# EAGLE design board (EAGLE 7.5.0)
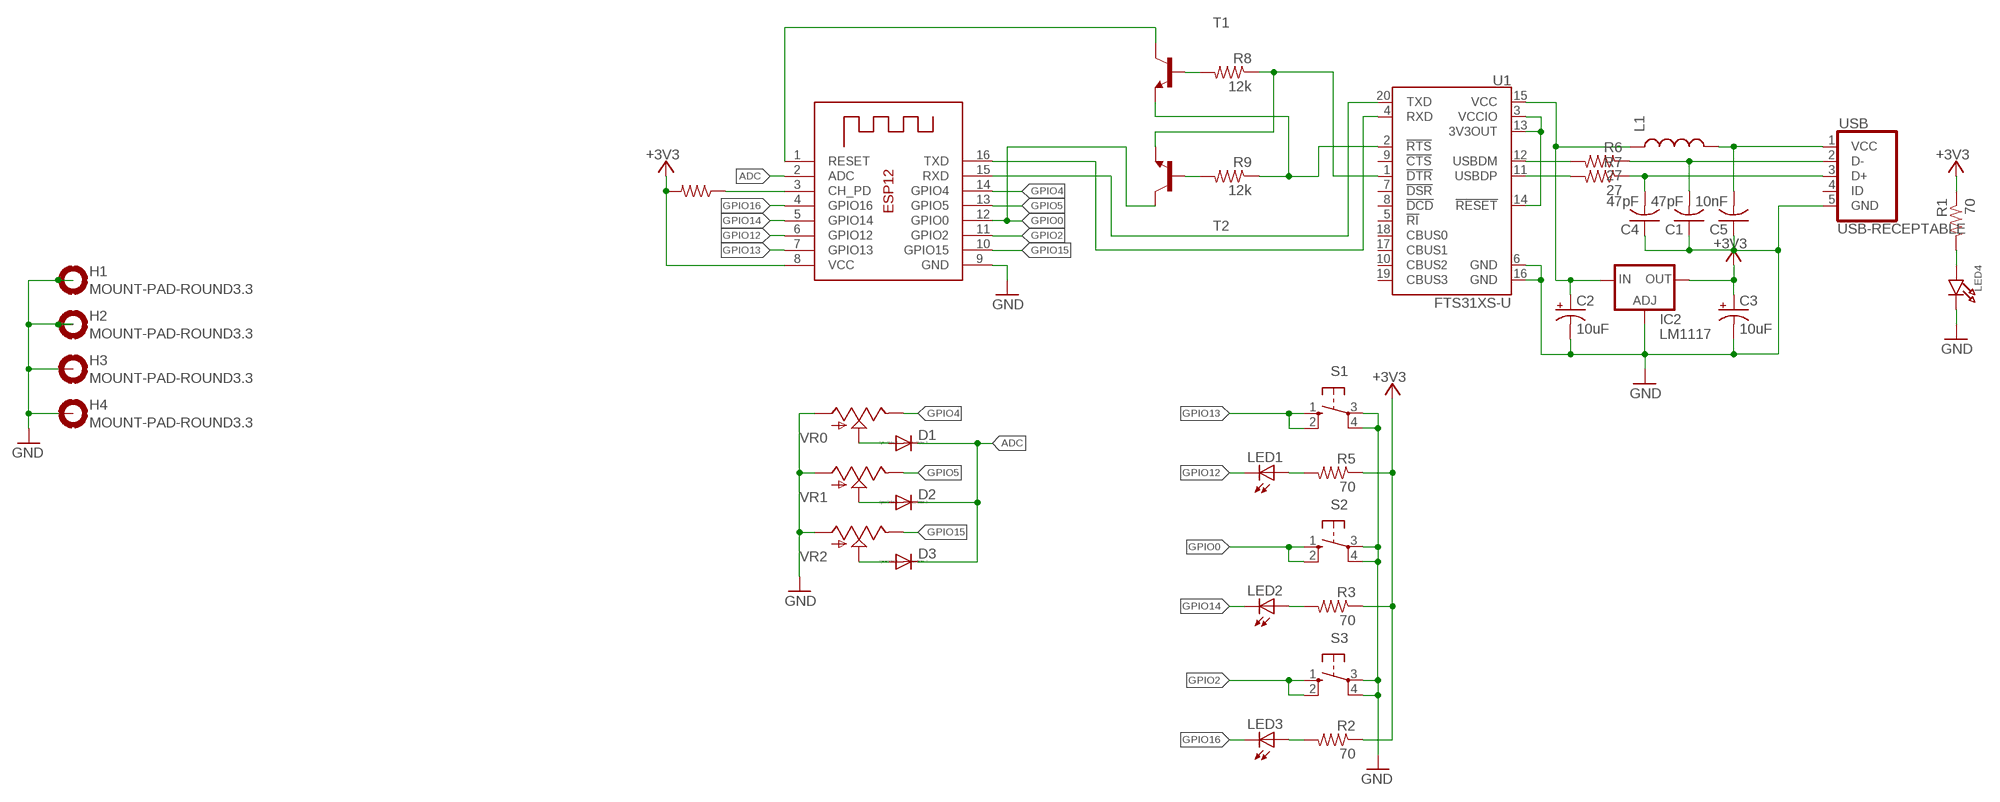
[diagram p0: schematic, sheet 1]

## Parts
C1  47pF  C-USC0603  [C0603]
C2  10uF  CPOL-US153CLV-0405  [153CLV-0405]
C3  10uF  CPOL-US153CLV-0405  [153CLV-0405]
C4  47pF  C-USC0603  [C0603]
C5  10nF  C-USC0603  [C0603]
D1  DIODE-DO214AC  [DO214AC]
D2  DIODE-DO214AC  [DO214AC]
D3  DIODE-DO214AC  [DO214AC]
H1  MOUNT-PAD-ROUND3.3  [3,3-PAD]
H2  MOUNT-PAD-ROUND3.3  [3,3-PAD]
H3  MOUNT-PAD-ROUND3.3  [3,3-PAD]
H4  MOUNT-PAD-ROUND3.3  [3,3-PAD]
IC2  LM1117  LD117ADT-TR  [DPACK]
L1  INDUCTOR0805  [0805]
LED1  LED3MM  [LED3MM]
LED2  LED3MM  [LED3MM]
LED3  LED3MM  [LED3MM]
LED4  LED0805  [CHIPLED_0805]
R1  70  R-US_R0603  [R0603]
R2  70  R-US_R0603  [R0603]
R3  70  R-US_R0603  [R0603]
R4  10k  R-US_R0603  [R0603]
R5  70  R-US_R0603  [R0603]
R6  27  R-US_R0603  [R0603]
R7  27  R-US_R0603  [R0603]
R8  12k  R-US_R0603  [R0603]
R9  12k  R-US_R0603  [R0603]
S1  10-XX  [B3F-10XX]
S2  10-XX  [B3F-10XX]
S3  10-XX  [B3F-10XX]
T1  MMBT918LT1-NPN-SOT23-BEC  [SOT23-BEC]
T2  MMBT918LT1-NPN-SOT23-BEC  [SOT23-BEC]
U1  FTS31XS-U  FT231XS  [SSOP20_L]
USB  USB-RECEPTABLE  [FCI-10103594-0001LF]
VR0  SLIDERPTA3043  [PTA3043-2015CPB103]
VR1  SLIDERPTA3043  [PTA3043-2015CPB103]
VR2  SLIDERPTA3043  [PTA3043-2015CPB103]
X1  ESP-12  [ESP-12]

## Nets
+3V3: C3.+ IC2.4(OUT) R1.1 R2.1 R3.1 R4.2 R5.1 X1.8(VCC)
ADC: D1.C D2.C D3.C X1.2(ADC)
GND: C1.1 C2.- C3.- C4.1 C5.1 H1.B3,3(MOUNT) H2.B3,3(MOUNT) H3.B3,3(MOUNT) H4.B3,3(MOUNT) IC2.1(ADJ) LED4.C S1.3(P) S1.4(P1) S2.3(P) S2.4(P1) S3.3(P) S3.4(P1) U1.6(GND) U1.16(GND) USB.5(GND) VR0.P$1(A) VR1.P$1(A) VR2.P$1(A) X1.9(GND)
GPIO0: S2.1(S) S2.2(S1) T2.C X1.12(GPIO0)
GPIO2: S3.1(S) S3.2(S1) X1.11(GPIO2)
GPIO4: VR0.P$3(E) X1.14(GPIO4)
GPIO5: VR1.P$3(E) X1.13(GPIO5)
GPIO12: LED1.K(C) X1.6(GPIO12)
GPIO13: S1.1(S) S1.2(S1) X1.7(GPIO13)
GPIO14: LED2.K(C) X1.5(GPIO14)
GPIO15: VR2.P$3(E) X1.10(GPIO15)
GPIO16: LED3.K(C) X1.4(GPIO16)
N$1: R4.1 X1.3(CH_PD)
N$2: C4.2 R7.1 USB.3(D+)
N$3: R7.2 U1.11(USBDP)
N$4: LED4.A R1.2
N$5: D1.A VR0.P$2(S)
N$6: LED1.A R5.2
N$7: C5.2 L1.2 USB.1(VCC)
N$8: LED2.A R3.2
N$9: R6.2 U1.12(USBDM)
N$10: LED3.A R2.2
N$11: D2.A VR1.P$2(S)
N$12: D3.A VR2.P$2(S)
N$13: C1.2 R6.1 USB.2(D-)
N$14: R8.1 T2.E U1.1(!DTR)
N$15: R9.1 T1.E U1.2(!RTS)
N$16: R8.2 T1.B
N$17: R9.2 T2.B
N$19: U1.3(VCCIO) U1.13(3V3OUT) U1.14(!RESET)
N$20: C2.+ IC2.3(IN) L1.1 U1.15(VCC)
RST: T1.C X1.1(RESET)
RXI: U1.20(TXD) X1.15(RXD)
TXO: U1.4(RXD) X1.16(TXD)
Unconnected: U1.5(!RI) U1.7(!DSR) U1.8(!DCD) U1.9(!CTS) U1.10(CBUS2) U1.17(CBUS1) U1.18(CBUS0) U1.19(CBUS3) USB.4(ID)

## Library data of the parts
C1 C4 C5 = rcl:C-US: CAPACITOR, American symbol
C2 C3 = rcl:CPOL-US: POLARIZED CAPACITOR, American symbol
D1-D3 = diode:DIODE-: DIODE
H1-H4 = holes:MOUNT-PAD-ROUND: MOUNTING PAD, round
IC2 = v-reg:LD117A?*: Low drop fixed and adjustable positive voltage regulators 1 A Source: http://www.st.com/stonline/products/literature/ds/7194/ld1117axx.pdf
L1 = SparkFun-Passives:INDUCTOR: Inductors Basic Inductor/Choke - 0603 and 1206. Footprints are not proven and vary greatly between part numbers. INDUCTOR POWER 3.3UH 4.0A SMD 0.197" L x 0.197" W x 0.177" H (5.00mm x 5.00mm x 4.50mm)
LED1-LED3 = adafruit:LED: LED
LED4 = microbuilder:LED: LED
R1-R9 = resistor:R-US_: RESISTOR, American symbol
S1-S3 = switch-omron:10-XX: OMRON SWITCH; MPN: B3F-1000; OC_FARNELL: 176432; OC_NEWARK: 36M3542
T1 T2 = transistor:*-NPN-: NPN Transistror BF959 corrected 2008.03.06
U1 = SparkFun-DigitalIC:FT231X: FTDI FT231X Full Speed USB to Full-handshake UART This USB2.0 Full Speed IC offers a compact bridge to full handshake UART interfaces. The device is a UART, capable of operating up to 3MBaud, with low power consumption (8mA). The FT231X includes the complete FT-X series feature set and enables USB to be added into a system design quickly and easily over a UART interface.; PROD_ID: IC-11524
USB = daspilker:USB-RECEPTABLE: USB Receptable
VR0 VR1 VR2 = SparkFun-Electromechanical:SLIDER: Slide-type potentiometers. Small and meduim footprints untested.
X1 = adafruit:ESP-12

## Net classes
1 ext: width 1.93 mm, clearance 1 mm
2 5v: width 0.61 mm

## Board
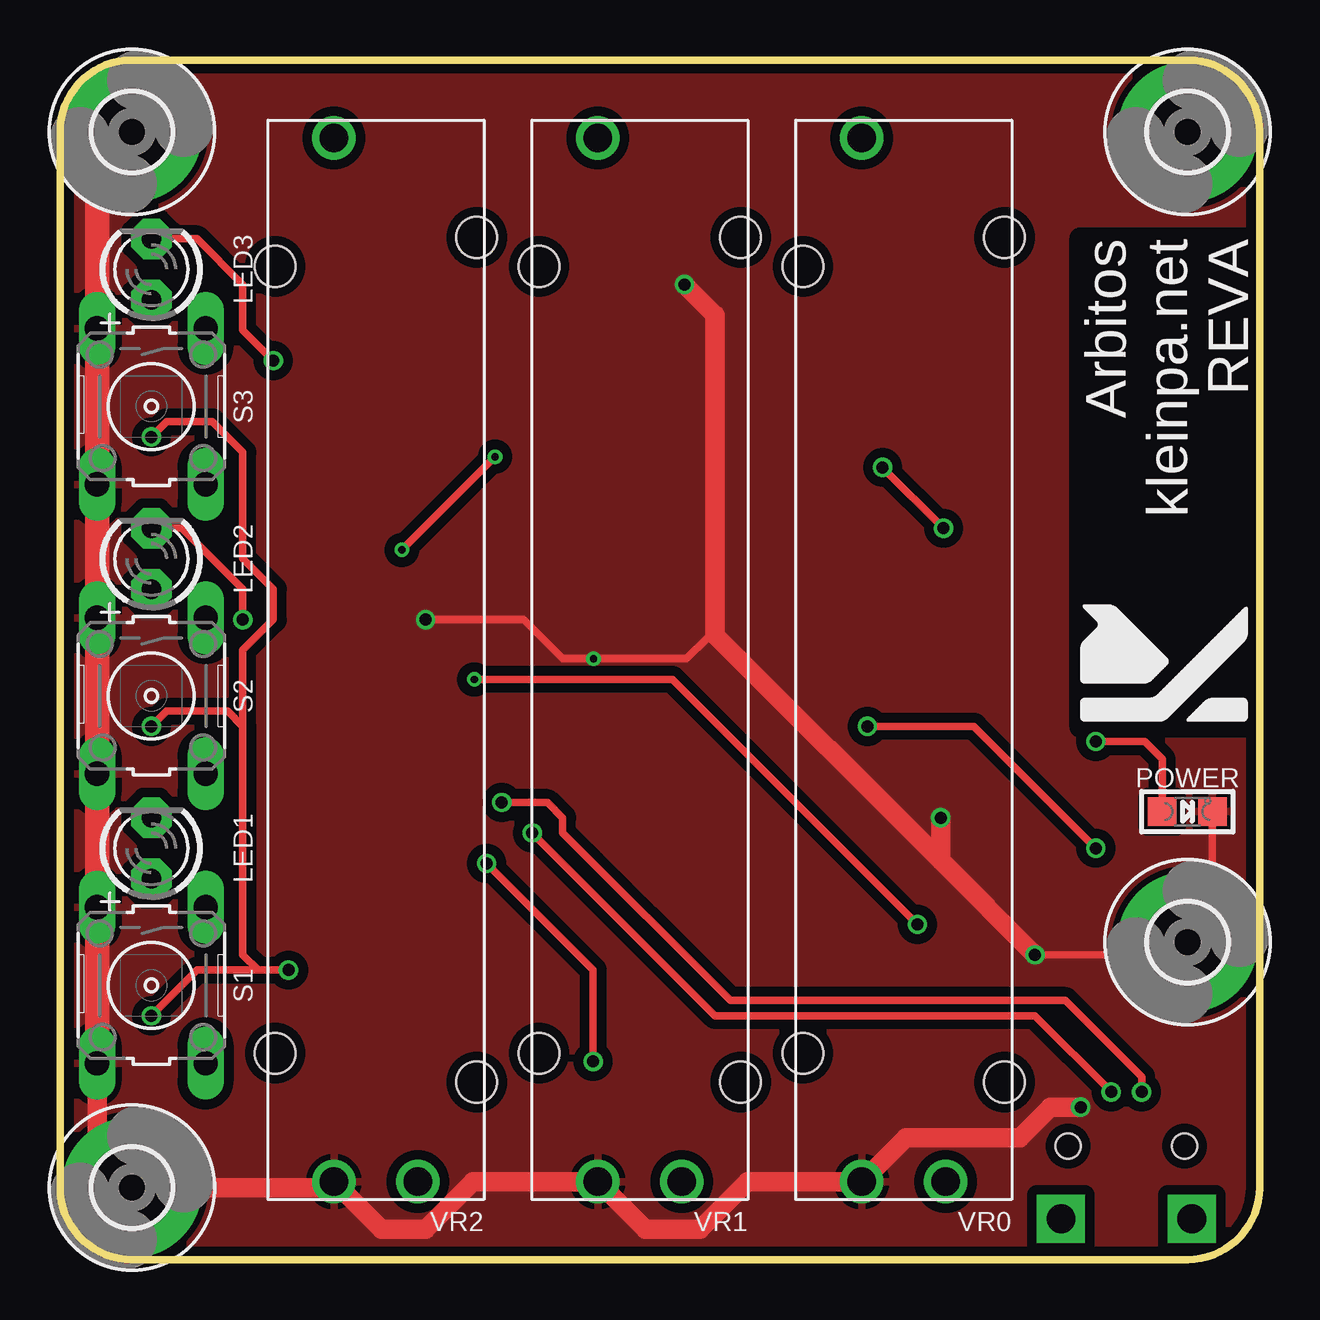
[diagram p1: board, top side]
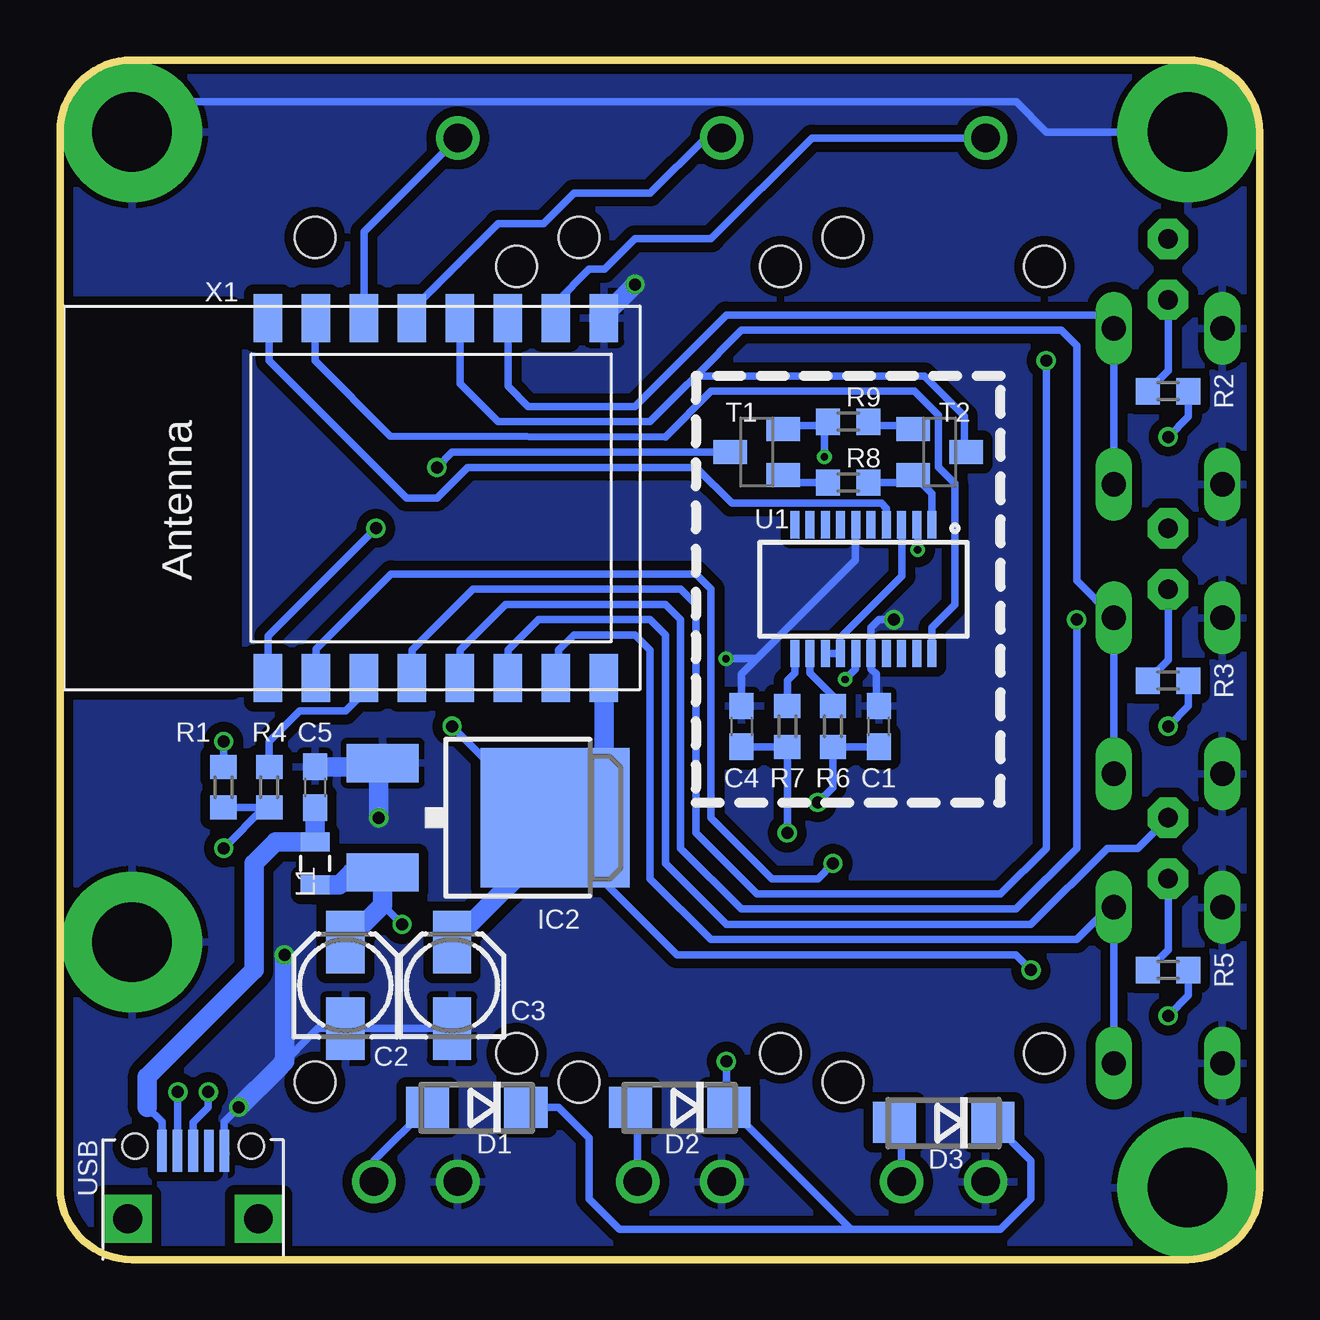
[diagram p2: board, bottom side, seen from below]

Size 50 x 50 mm. Coordinates in mm from the lower left corner, seen from the top.
Outline: 0,47 0,3 arc90 3,0 47,0 arc90 50,3 50,47 arc90 47,50 3,50 arc90 0,47
Copper layers (1*16): Top 0.035mm / dielectric 1.5mm / Bottom 0.035mm
Design rules "dirt_cheap_dirty_boards.v1": minimum track width 5mil, minimum drill 12mil, track to track 5mil, track to pad 5mil, pad to pad 5mil, via to via 5mil, smd to smd 0mil, copper to edge 10mil, drill to drill 10mil, minimum pad ring 10mil, minimum via ring 6mil, stop-mask expansion 2mil, vias tented up to drill 25mil, thermal gap 10mil

### Footprints (pad centres in the part's own frame; a part is rotated, then mirrored left to right if it is on the bottom)
C0603 = smd 1.1 x 1: 1 -0.85,0; 2 0.85,0
153CLV-0405 = smd 2.6 x 1.6: + 1.8,0; - -1.8,0
DO214AC = smd 1.8 x 1.7: A 2.05,0; C -2.05,0
3,3-PAD = drill 3.3 pad 5.842: B3,3 0,0
DPACK = smd 1.6 x 3: 1 -2.28,-4.8; 3 2.28,-4.8 | smd 5.8 x 6.2: 4 0,2.38
0805 = smd 0.8 x 1.2: 1 -0.9,0; 2 0.9,0
LED3MM = drill 0.813 pad 1.676 octagon: A -1.27,0; K 1.27,0
CHIPLED_0805 = smd 1.2 x 1.2: A 0,-1.05; C 0,1.05
R0603 = smd 1 x 1.1: 1 -0.85,0; 2 0.85,0
B3F-10XX = drill 1.016 long: 1 -3.251,2.261; 2 3.251,2.261; 3 -3.251,-2.261; 4 3.251,-2.261
SOT23-BEC = smd 1 x 1.4: B -0.95,-1.1; C 0,1.1; E 0.95,-1.1
SSOP20_L = smd 0.381 x 1.143: 1 -2.857,-2.68; 2 -2.223,-2.68; 3 -1.587,-2.68; 4 -0.953,-2.68; 5 -0.318,-2.68; 6 0.318,-2.68; 7 0.953,-2.68; 8 1.587,-2.68; 9 2.223,-2.68; 10 2.857,-2.68; 11 2.857,2.68; 12 2.223,2.68; 13 1.587,2.68; 14 0.953,2.68; 15 0.318,2.68; 16 -0.318,2.68; 17 -0.953,2.68; 18 -1.587,2.68; 19 -2.223,2.68; 20 -2.857,2.68
FCI-10103594-0001LF = smd 0.4 x 1.75: 1 -1.3,4.525; 2 -0.65,4.525; 3 0,4.525; 4 0.65,4.525; 5 1.3,4.525 | drill 1.2 pad 2 square: P$3 -2.725,1.7; P$4 2.725,1.7 | hole 1.05: -2.425,4.73; 2.425,4.73
PTA3043-2015CPB103 = drill 1.2: P$1 -21.75,1.75; P$2 -21.75,-1.75; P$3 21.75,1.75 | hole 1.7: -16.4,4.2; 16.4,4.2; -17.6,-4.2; 17.6,-4.2
ESP-12 = smd 2 x 1.2: 1 -7.5,4.5; 2 -7.5,2.5; 3 -7.5,0.5; 4 -7.5,-1.5; 5 -7.5,-3.5; 6 -7.5,-5.5; 7 -7.5,-7.5; 8 -7.5,-9.5; 9 7.5,-9.5; 10 7.5,-7.5; 11 7.5,-5.5; 12 7.5,-3.5; 13 7.5,-1.5; 14 7.5,0.5; 15 7.5,2.5; 16 7.5,4.5

### Placement (x,y rotation side)
C1  15.88,22.23 270 bottom
C2  38.1,11.43 90 bottom
C3  33.66,11.43 90 bottom
C4  21.59,22.23 270 bottom
C5  39.37,19.68 270 bottom
D1  32.63,6.35 180 bottom
D2  24.17,6.35 180 bottom
D3  13.17,5.71 180 bottom
H1  47,13.23 0 top
H2  3,3 0 top
H3  47,47 0 top
H4  3,47 0 top
IC2  31.75,18.41 270 bottom
L1  39.37,16.51 90 bottom
LED1  3.81,17.14 90 top
LED2  3.81,29.21 90 top
LED3  3.81,41.27 90 top
LED4  46.99,18.67 270 top
R1  43.18,19.68 90 bottom
R2  3.81,36.2 180 bottom
R3  3.81,24.13 180 bottom
R4  41.27,19.68 270 bottom
R5  3.81,12.06 180 bottom
R6  17.78,22.23 90 bottom
R7  19.68,22.23 90 bottom
R8  17.14,32.38 180 bottom
R9  17.14,34.92 0 bottom
S1  3.81,11.43 270 top
S2  3.81,23.5 270 top
S3  3.81,35.56 270 top
T1  20.95,33.66 90 bottom
T2  13.34,33.66 270 bottom
U1  16.51,27.94 180 bottom
USB  44.45,0 0 bottom
VR0  35.17,25 90 top
VR1  24.17,25 90 top
VR2  13.17,25 90 top
X1  36.83,31.75 90 bottom

### Tracks (layer width: path | path; a pad name or v marks a point on that pad's centre or on a via)
+3V3  (via drill 0.5)
  Top 0.305: v3.81,34.29 4.45,34.92 6.35,34.92 7.62,33.66 7.62,29.21 8.89,27.94 8.89,26.67 7.62,25.4 7.62,22.23 | v3.81,10.16 5.71,12.06 8.26,12.06 | 8.26,12.06 v9.53,12.06 | v3.81,22.23 4.45,22.86 6.99,22.86 7.62,22.23 | v43.18,17.14 38.1,22.23 v33.66,22.23 | 7.62,22.23 7.62,12.7 8.26,12.06
  Bottom 0.305: R2.1 2.96,35.14 v3.81,34.29 | v9.53,12.06 10.16,12.7 24.29,12.7 29.37,17.78 | R5.1 2.96,11.01 v3.81,10.16 | R3.1 2.96,23.07 v3.81,22.23 | R1.1 R4.2 41.49,18.84 v43.18,17.14 | v33.66,22.23 30.24,18.81 28.97,18.81
  Bottom 0.813: C3.+ 29.37,17.52 29.37,17.78 IC2.4 28.97,18.81 27.33,20.45 X1.8
ADC  (via drill 0.5)
  Top 0.305: v17.78,16.51 22.23,12.06 v22.23,8.26
  Bottom 0.305: 17.04,1.27 10.79,1.27 9.53,2.54 9.53,4.12 D3.C | 17.04,1.27 D2.C 22.23,6.35 v22.23,8.26 | 17.04,1.27 22.23,1.27 22.86,1.27 26.67,1.27 27.94,2.54 27.94,5.08 29.21,6.35 D1.C | X1.2 39.33,25.44 36.2,28.57 23.5,28.57 22.86,27.94 22.86,18.41 20.32,15.88 18.41,15.88 v17.78,16.51
GND  (via drill 0.3, 0.5)
  Top 0.305: v40.64,12.7 46.47,12.7 H1.B3,3 48.04,14.27 LED4.C | 27.3,26.04 26.99,25.91 26.12,25.04 v22.24,25.04 20.94,25.04 19.32,26.67 v15.24,26.67
  Top 0.813: S1.4 1.55,4.45 H2.B3,3 11.17,3 VR2.P$1 13.4,1.27 15.24,1.27 17.22,3.25 VR1.P$1 24.4,1.27 26.67,1.27 28.65,3.25 VR0.P$1 35.25,5.08 40.01,5.08 41.27,6.35 v42.55,6.35 | v36.71,18.41 36.71,16.63 | 36.71,16.63 v40.64,12.7 | 36.71,16.63 27.3,26.04 27.3,39.37 v26.04,40.64
  Top 1.016: S1.4 S1.3 S2.4 S2.3 S3.4 S3.3 1.55,45.55 H4.B3,3
  Bottom 0.305: USB.5 43.15,5.75 v42.55,6.35 | H3.B3,3 45.74,48.26 10.14,48.26 8.88,47 H4.B3,3 | C3.- C2.- 39.27,9.63 40.96,7.94 | 15.98,22.87 C1.1 15.98,23.09 15.98,24.4 16.19,24.61 U1.16 16.19,26.35 15.88,26.67 v15.24,26.67 | 20.94,25.04 16.84,29.15 16.84,30.44 U1.6 | v22.24,25.04 20.94,25.04 | 21.59,22.87 C4.1 21.59,24.4 20.94,25.04
  Bottom 0.813: IC2.1 36.71,20.54 | 36.71,20.54 C5.1 | 36.71,20.54 v36.71,18.41 | v40.64,12.7 40.64,8.26 40.96,7.94 v42.55,6.35 | X1.9 27.33,39.34 v26.04,40.64
  pour Top (isolate 0.406): -3.81,50.8 50.8,50.8 50.8,43.18 42.55,43.18 arc90 41.91,42.55 41.91,22.23 arc90 42.55,21.59 52.07,21.59 52.07,-1.27 -1.27,-1.27 -1.27,48.26 -3.81,48.26
  pour Bottom (isolate 0.406): -3.81,46.99 -1.27,46.99 -1.27,50.8 50.8,50.8 50.8,49.53 52.07,49.53 52.07,-1.27 -1.27,-1.27 -1.27,44.45 -3.81,44.45
GPIO0
  Bottom 0.305: S2.2 S2.1 7.62,28.3 7.62,38.1 8.26,38.73 21.59,38.73 23.5,36.83 | X1.12 33.33,36.51 31.75,34.92 25.4,34.92 24.13,36.2 23.5,36.83 | T2.C 12.31,33.68 12.31,35.17 13.97,36.83 23.5,36.83
GPIO2
  Bottom 0.305: X1.11 31.33,36.41 30.48,35.56 26.04,35.56 22.23,39.37 6.63,39.37 S3.1 S3.2
GPIO4
  Bottom 0.305: X1.14 37.33,42.84 VR0.P$3
GPIO5
  Bottom 0.305: VR1.P$3 23.1,46.75 25.4,44.45 28.57,44.45 29.84,43.18 31.75,43.18 35.33,39.6 X1.13
GPIO12
  Bottom 0.305: LED1.K 5.08,17.14 6.35,17.14 9.53,13.97 22.23,13.97 24.77,16.51 24.77,26.04 25.4,26.67 30.06,26.67 31.33,25.4 X1.6
GPIO13
  Bottom 0.305: S1.2 S1.1 6.27,14.68 7.62,13.34 22.86,13.34 25.4,15.88 25.4,25.4 26.04,26.04 28.57,26.04 29.21,25.4 29.21,24.37 X1.7
GPIO14  (via drill 0.5)
  Top 0.305: v7.62,26.67 7.62,27.94 5.08,30.48 LED2.K
  Bottom 0.305: X1.5 33.33,25.4 31.43,27.3 24.77,27.3 24.13,26.67 24.13,17.14 21.59,14.61 10.16,14.61 7.62,17.14 v7.62,26.67
GPIO15
  Bottom 0.305: VR2.P$3 18.66,46.75 22.86,42.55 26.04,42.55 27.3,41.27 27.94,41.27 29.33,39.88 X1.10
GPIO16  (via drill 0.5)
  Top 0.305: v8.89,37.47 7.62,38.73 7.62,40.64 5.71,42.55 LED3.K
  Bottom 0.305: X1.4 35.33,25.4 32.79,27.94 24.13,27.94 23.5,27.3 23.5,17.78 20.95,15.24 10.79,15.24 8.89,17.14 v8.89,37.47
N$1
  Bottom 0.305: R4.1 41.27,21.59 40.01,22.86 38.1,22.86 37.33,23.63 X1.3
N$2  (via drill 0.5)
  Top 0.305: v43.81,6.99 40.64,10.16 27.3,10.16 v19.68,17.78
  Bottom 0.305: USB.3 44.45,5.71 43.81,6.35 v43.81,6.99 | v19.68,17.78 R7.1 C4.2
N$3
  Bottom 0.305: U1.11 19.37,24.45 19.68,24.13 R7.2
N$4  (via drill 0.5)
  Top 0.305: v43.18,21.59 45.21,21.59 45.94,20.86 LED4.A
  Bottom 0.305: R1.2 v43.18,21.59
N$5
  Bottom 0.305: VR0.P$2 36.92,4.11 D1.A
N$6
  Bottom 0.305: LED1.A 3.81,12.91 R5.2
N$7
  Bottom 0.305: USB.1 45.75,5.75 46.35,6.35
  Bottom 0.813: 46.35,6.35 46.35,7.62 41.91,12.06 41.91,16.51 41.01,17.41 L1.2 C5.2
N$8
  Bottom 0.305: LED2.A 3.81,24.98 R3.2
N$9
  Bottom 0.305: U1.12 18.73,24.45 17.78,23.5 R6.2
N$10
  Bottom 0.305: LED3.A 3.81,37.05 R2.2
N$11
  Bottom 0.305: 25.92,6.05 25.92,6.04 | 25.92,6.04 VR1.P$2 | D2.A 26.12,6.26 25.91,6.04 25.92,6.04
N$12
  Bottom 0.305: D3.A 14.92,5.42 VR2.P$2
N$13  (via drill 0.5)
  Top 0.305: v45.09,6.99 45.09,7.62 41.91,10.79 27.94,10.79 20.95,17.78 20.95,18.41 20.32,19.05 v18.41,19.05
  Bottom 0.305: USB.2 45.1,6.97 v45.09,6.99 | v18.41,19.05 17.78,19.68 R6.1 C1.2
N$14
  Bottom 0.305: R8.1 14.68,32.38 14.46,32.6 T2.E | 14.25,32.6 T2.E | U1.1 13.65,31.92 T2.E
N$15  (via drill 0.3)
  Top 0.305: v18.14,33.47 v14.25,29.58
  Bottom 0.305: 18.14,34.76 19.65,34.76 T1.E | v14.25,29.58 14.25,30.44 U1.2 | 18.14,34.76 v18.14,33.47 | 18.14,34.76 R9.1
N$16
  Bottom 0.305: R8.2 19.43,32.38 19.65,32.6 T1.B
N$17
  Bottom 0.305: R9.2 16.19,34.76 14.46,34.76 T2.B
N$19
  Bottom 0.305: U1.13 17.49,25.26 | 17.49,25.26 17.49,25.91 14.9,28.5 14.9,30.44 U1.3 | 17.49,25.26 U1.14
N$20  (via drill 0.3, 0.5)
  Top 0.305: v17.27,24.18 25.53,24.18 v35.74,13.97
  Bottom 0.305: 36.55,14.78 v35.74,13.97 | v17.27,24.18 16.84,24.61 U1.15
  Bottom 0.813: C2.+ 36.55,14.78 IC2.3 37.84,16.14 38.37,15.61 L1.1
RST  (via drill 0.5)
  Top 0.305: v34.29,33.02 v36.83,30.48
  Bottom 0.305: T1.C 33.66,33.66 v34.29,33.02 | v36.83,30.48 41.33,25.98 X1.1
RXI
  Bottom 0.305: X1.15 39.37,39.21 39.37,37.47 36.23,34.33 24.77,34.29 22.86,36.2 14.39,36.2 13.39,35.19 13.39,33.03 12.7,32.35 12.7,27.3 13.65,26.35 U1.20
TXO
  Bottom 0.305: U1.4 15.54,30.66 15.54,31.3 15.76,31.52 22,31.52 23.5,33.02 33.02,33.02 34.29,31.75 35.56,31.75 41.27,37.47 41.27,39.2 X1.16

### Text on the board
tNames: Arbitos / kleinpa.net / REVA | C:/Users/klein/Projects/logo/logo.bmp | POWER